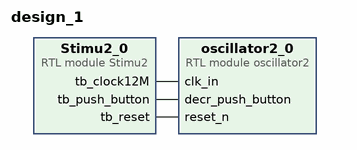
[diagram p0: block diagram of the top level]
# Vivado block design design_1, xc7a35tcpg236-1, Vivado 2024.2
create_bd_design design_1

create_bd_cell -type module -reference oscillator2 oscillator2_0
create_bd_cell -type module -reference Stimu2 Stimu2_0

# ---- connections ----

connect_bd_net [get_bd_pins Stimu2_0/tb_clock12M] [get_bd_pins oscillator2_0/clk_in]
connect_bd_net [get_bd_pins Stimu2_0/tb_push_button] [get_bd_pins oscillator2_0/decr_push_button]
connect_bd_net [get_bd_pins Stimu2_0/tb_reset] [get_bd_pins oscillator2_0/reset_n]

validate_bd_design
save_bd_design
